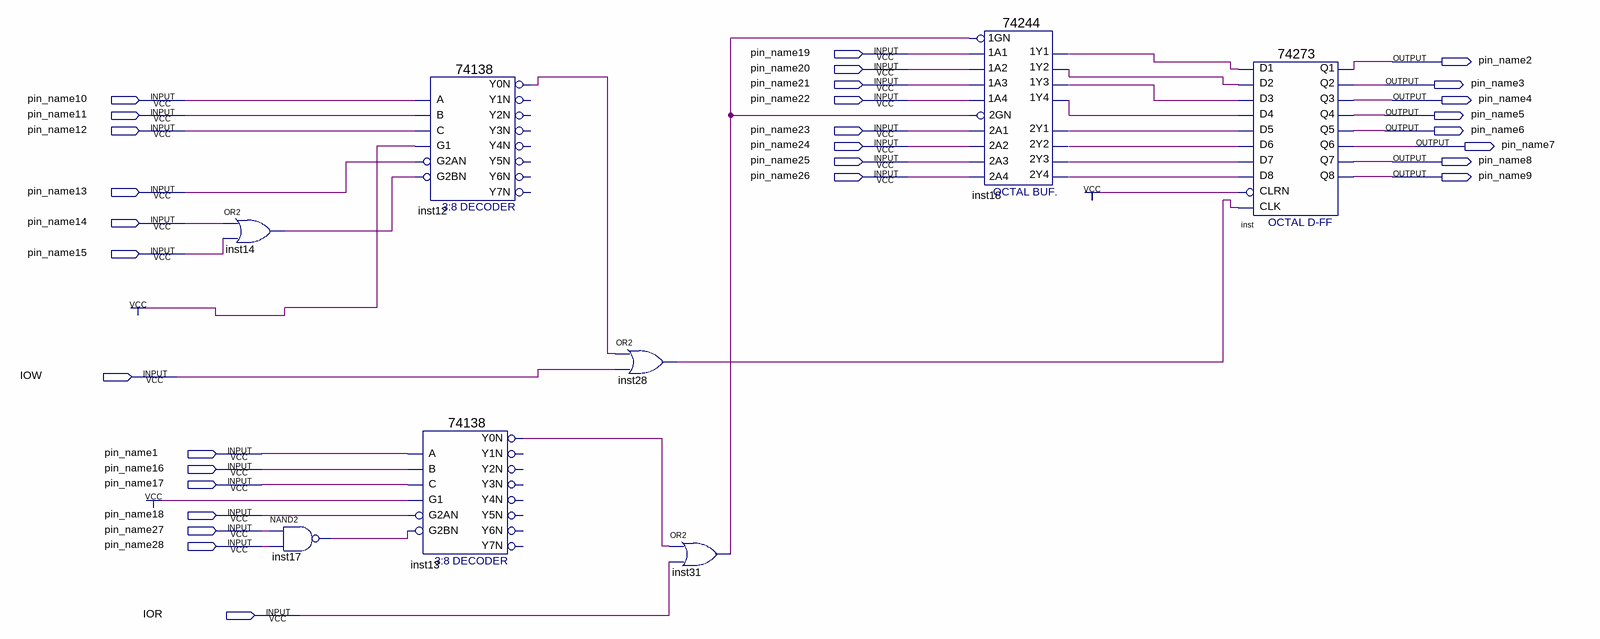
[diagram p0: schematic sheet]
// Quartus schematic Block1.bdf as structural Verilog: 8 symbols, 30 pins
module Block1 (
  input  pin_name19,
  input  pin_name20,
  input  pin_name21,
  input  pin_name10,
  input  pin_name22,
  input  pin_name11,
  input  pin_name12,
  input  pin_name23,
  input  pin_name24,
  input  pin_name25,
  input  pin_name26,
  input  pin_name13,
  input  pin_name14,
  input  pin_name15,
  input  IOW,
  input  pin_name1,
  input  pin_name16,
  input  pin_name17,
  input  pin_name18,
  input  pin_name27,
  input  pin_name28,
  input  IOR,
  output pin_name2,
  output pin_name3,
  output pin_name4,
  output pin_name5,
  output pin_name6,
  output pin_name7,
  output pin_name8,
  output pin_name9
);

  wire inst12_y0n, inst13_y0n, inst14_out, inst17_out, inst18_1y1, inst18_1y2, inst18_1y3, inst18_1y4,
       inst18_2y1, inst18_2y2, inst18_2y3, inst18_2y4, inst28_out, inst31_out;

  or inst14 (inst14_out, pin_name14, pin_name15);
  nand inst17 (inst17_out, pin_name27, pin_name28);
  \74138  inst12 (
    .A(pin_name10), .B(pin_name11), .G1(1'b1), .C(pin_name12), .G2AN(pin_name13), .G2BN(inst14_out),
    .Y0N(inst12_y0n));  // open: Y1N, Y2N, Y3N, Y4N, Y5N, Y6N, Y7N
  \74138  inst13 (
    .A(pin_name1), .B(pin_name16), .G1(1'b1), .C(pin_name17), .G2AN(pin_name18), .G2BN(inst17_out),
    .Y0N(inst13_y0n));  // open: Y1N, Y2N, Y3N, Y4N, Y5N, Y6N, Y7N
  or inst28 (inst28_out, inst12_y0n, IOW);
  or inst31 (inst31_out, inst13_y0n, IOR);
  \74244  inst18 (
    .\1A2 (pin_name20), .\1A4 (pin_name22), .\1A1 (pin_name19), .\1A3 (pin_name21), .\1GN (inst31_out),
    .\2A3 (pin_name25), .\2GN (inst31_out), .\2A1 (pin_name23), .\2A4 (pin_name26), .\2A2 (pin_name24),
    .\1Y2 (inst18_1y2), .\1Y4 (inst18_1y4), .\2Y1 (inst18_2y1), .\1Y1 (inst18_1y1), .\2Y3 (inst18_2y3),
    .\2Y4 (inst18_2y4), .\1Y3 (inst18_1y3), .\2Y2 (inst18_2y2));
  \74273  inst (
    .D2(inst18_1y2), .D3(inst18_1y3), .D1(inst18_1y1), .D4(inst18_1y4), .D7(inst18_2y3), .D6(inst18_2y2),
    .D5(inst18_2y1), .D8(inst18_2y4), .CLK(inst28_out), .CLRN(1'b1), .Q4(pin_name5), .Q1(pin_name2),
    .Q2(pin_name3), .Q3(pin_name4), .Q6(pin_name7), .Q5(pin_name6), .Q7(pin_name8), .Q8(pin_name9));
endmodule
